# Altium schematic sheet FRC0603F1473TS1_FRC0603F1473TS.schdoc
size 127 x 99 mm
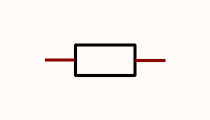
[diagram p0: FRC0603F1473TS1_FRC0603F1473TS.schdoc]

## Parts
U?  147kΩ  [R0603]  (value not drawn)

## Nets

Not connected (* = marked no-connect by the designer): U? 1 2

## Library data of the parts
U? = FRC0603F1473TS: Manufacturer: FOJAN(富捷); Add into BOM: yes; Tolerance: ±1%; Power(Watts): 100mW; Overload Voltage (Max): 75V; Temperature Coefficient: ±100ppm/℃; Symbol: FRC0603F1473TS; Device: FRC0603F1473TS; LCSC Part Name: 147kΩ ±1% 100mW 厚膜电阻; Supplier Part: C2998060; Manufacturer Part: FRC0603F1473TS; Supplier Footprint: 0603; JLCPCB Part Class: Extended Part; Datasheet: https://atta.szlcsc.com/upload/public/pdf/source/20211221/925EC7D7225764EE0046F22065062C87.pdf; Supplier: LCSC; Convert to PCB: yes; Type: 厚膜电阻; Value: 147kΩ; Operating Temperature Range: -55℃~+155℃